# Altium schematic sheet 05 SERVO_FAN_LED.SchDoc
size A
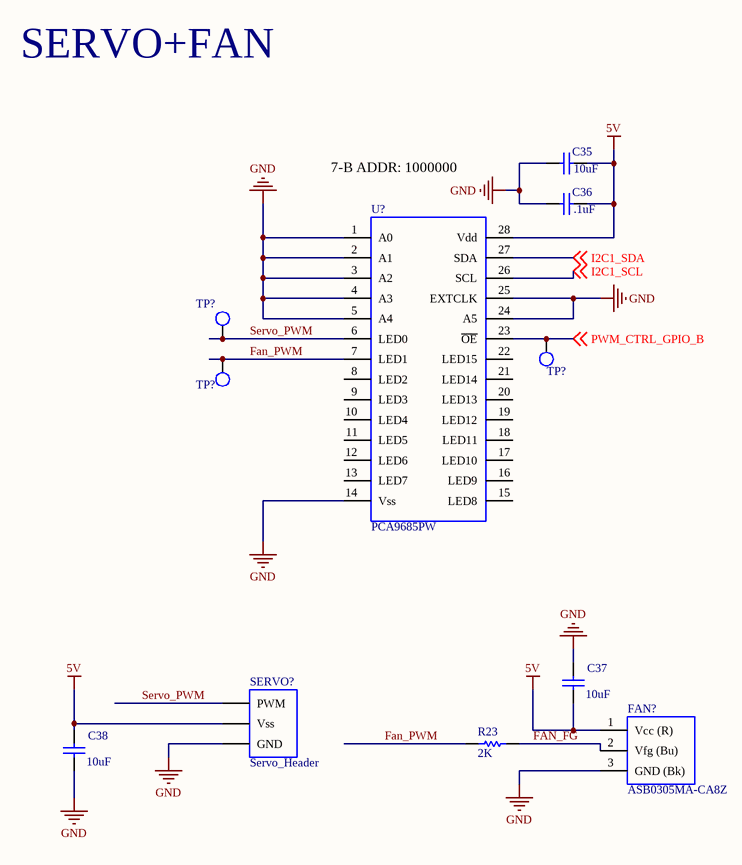
[diagram p0: 05 SERVO_FAN_LED.SchDoc]

## Parts
(Parts that share a designator on the sheet are numbered #1, #2 ... from top to bottom, then left to right.)
C35  value 10uF  [CAPC2012X135N]  (hidden comment: CAP_0805_10u_16V)
C36  value .1uF  [CAPC2012X135N]  (hidden comment: CAP_0805_.1u_250V)
C37  value 10uF  [CAPC2012X135N]  (hidden comment: CAP_0805_10u_16V)
C38  value 10uF  [CAPC2012X135N]  (hidden comment: CAP_0805_10u_16V)
FAN?  ASB0305MA-CA8Z  [FAN_HEADER]
R23  RES_0805_2K  [RES0805]  (value not drawn)
SERVO?  Servo_Header
TP?#1  TP  [TestPoint_1206]  (value not drawn)
TP?#2  TP  [TestPoint_1206]  (value not drawn)
TP?#3  TP  [TestPoint_1206]  (value not drawn)
U?  PCA9685PW  [TSSOP28]

## Nets
5V: C35.2 C36.2 C37.1 C38.2 FAN?.1(Vcc_(R)) SERVO?.2(Vss) U?.28(Vdd)
GND: C35.1 C36.1 C37.2 C38.1 FAN?.3(GND_(Bk)) SERVO?.3(GND) U?.1(A0) U?.2(A1) U?.3(A2) U?.4(A3) U?.5(A4) U?.14(Vss) U?.24(A5) U?.25(EXTCLK)
FAN_FG: FAN?.2(Vfg_(Bu)) R23.2
Fan_PWM: R23.1 TP?#3.1 U?.7(LED1)
I2C1_SCL: U?.26(SCL) ; off-sheet I2C1_SCL
I2C1_SDA: U?.27(SDA) ; off-sheet I2C1_SDA
PWM_CTRL_GPIO_B: TP?#2.1 U?.23(~{OE}) ; off-sheet PWM_CTRL_GPIO_B
Servo_PWM: SERVO?.1(PWM) TP?#1.1 U?.6(LED0)

Not connected (* = marked no-connect by the designer): U? 8(LED2) 9(LED3) 10(LED4) 11(LED5) 12(LED6) 13(LED7) 15(LED8) 16(LED9) 17(LED10) 18(LED11) 19(LED12) 20(LED13) 21(LED14) 22(LED15)

## Notes on the sheet
- SERVO+FAN
- 7-B ADDR: 1000000
- (in symbol RES_0805_2K) 2K

## Library data of the parts
C35 C37 C38 = CAP_0805_10u_16V: Cap Ceramic 10uF 16V X5R 10% SMD 0805 85C T/R; Manufacturer: Johanson Dielectrics; Manufacturer Part Number: 160R15X106KV4E; Supplier 1: Digi-Key; Supplier Part Number 1: 709-1229-1-ND; Stock 1: 36636; Pricing 1: 1=0.55, 10=0.387, 100=0.2552, 500=0.189, 1000=0.1607 (USD); Mount: Surface Mount; Case/Package: 0805; Number of Pins: 2; Weight: 0.000194oz; Case Code (Imperial): 0805; Case Code (Metric): 2012; Min Operating Temperature: -55°C; Max Operating Temperature: 85°C; Voltage Rating: 16V; Capacitance: 10uF; Voltage Rating (DC): 16V; Tolerance: 10%; Packaging: Tape and Reel; Package Quantity: 2000; Dielectric: X5R; Termination: SMD/SMT; Length: 2.03mm; Height: 1.27mm; Width: 1.27mm; Thickness: 0.06inch; Depth: 1.27mm; Radiation Hardening: No; REACH SVHC: No SVHC; ComponentLink1URL: https://datasheet.ciiva.com/26948/getdatasheetpartid-132904-26948555.pdf; ComponentLink1Description: https://datasheet.ciiva.com/26948/getdatasheetpartid-132904-26948555.pdf
C36 = CAP_0805_.1u_250V: Cap Ceramic 0.1uF 250V X7T 10% SMD 0805 125C Plastic T/R; Manufacturer: TDK; Manufacturer Part Number: C2012X7T2E104K125AE; Capacitance: 100nF; Supplier 1: Digi-Key; Supplier Part Number 1: 445-8883-1-ND; Stock 1: 30376; Pricing 1: 1=0.37, 10=0.25, 100=0.1419, 500=0.1002, 1000=0.0877 (USD); Case/Package: 0805; Weight: 0.000194oz; Case Code (Metric): 2012; Case Code (Imperial): 0805; Min Operating Temperature: -55°C; Max Operating Temperature: 125°C; Package Quantity: 1; Voltage Rating: 250V; Tolerance: 10%; Packaging: Tape and Reel; Voltage Rating (DC): 250V; Dielectric: X7T; Termination: SMD/SMT; Composition: Ceramic; Length: 2mm; Height: 1.25mm; Width: 0.05inch; Thickness: 0.049inch; Depth: 1.25mm; REACH SVHC: No SVHC; ComponentLink1URL: https://datasheet.ciiva.com/24219/c2012x7t2e104k125ae-265154-24219519.pdf; ComponentLink1Description: https://datasheet.ciiva.com/24219/c2012x7t2e104k125ae-265154-24219519.pdf
FAN? = ASB0305MA-CA8Z: FAN AXIAL 30X10MM 5VDC WIRE; Manufacturer: Delta Design; Airflow: 3.4CFM; Noise: 23dBA; Current Rating: 110mA; Max Power Dissipation: 550mW; RPM: 9000RPM; Bearing Type: Sleeve; Supplier 1: Digi-Key; Supplier Part Number 1: 603-1847-ND; Manufacturer Part Number: ASB0305MA-CA8Z; Stock 1: 98; Pricing 1: 1=6.96, 10=6.38, 50=5.365 (USD); Weight: 0.015lb; Min Operating Temperature: 14°C; Max Operating Temperature: 158°C; Package Quantity: 720; Termination: 3 Wire Leads; Width: 10mm; ComponentLink1URL: //media.digikey.com/pdf/Data%20Sheets/Delta%20PDFs/ASB0305MA-CA8Z_Spec.pdf; ComponentLink1Description: //media.digikey.com/pdf/Data%20Sheets/Delta%20PDFs/ASB0305MA-CA8Z_Spec.pdf
R23 = RES_0805_2K: RES SMD 2K OHM 5% 1/8W 0805; Manufacturer: Yageo; Manufacturer Part Number: RC0805JR-072KL; Resistance: 2KR; Power Rating: 125mW; Voltage Rating: 150V; Temperature Coefficient: 100ppm/°C; Supplier 1: Digi-Key; Supplier Part Number 1: 311-2.0KARCT-ND; Stock 1: 297667; Pricing 1: 1=0.1, 10=0.016, 25=0.0116, 50=0.009, 100=0.0066, 250=0.005, 500=0.004, 1000=0.003 (USD); Case/Package: 0805; Number of Pins: 2; Case Code (Metric): 2012; Case Code (Imperial): 0805; Contact Plating: Tin,Lead,Matte; Min Operating Temperature: -55°C; Max Operating Temperature: 155°C; Tolerance: 5%; Packaging: Tape and Reel; Package Quantity: 1; Composition: Thick Film; Number of Terminations: 2; Termination: SMD/SMT; Military Standard: Not; Max Power Dissipation: 125mW; Voltage Rating (DC): 150V; Length: 2mm; Height: 0.024inch; Width: 0.049inch; Depth: 1.25mm; Radiation Hardening: No; REACH SVHC: No SVHC; Lead Free: Lead Free; ComponentLink1URL: https://datasheet.ciiva.com/46395/444164-46395141.pdf; ComponentLink1Description: https://datasheet.ciiva.com/46395/444164-46395141.pdf; ComponentLink2URL: https://datasheet.ciiva.com/2456/pyu-r-int-thick-7-2456104.pdf; ComponentLink2Description: https://datasheet.ciiva.com/2456/pyu-r-int-thick-7-2456104.pdf; ComponentLink3URL: https://datasheet.ciiva.com/2456/pyu-r-int-thick-7-2456105.pdf; ComponentLink3Description: https://datasheet.ciiva.com/2456/pyu-r-int-thick-7-2456105.pdf; ComponentLink4URL: https://datasheet.ciiva.com/2456/pyu-r-int-thick-7-2456106.pdf; ComponentLink4Description: https://datasheet.ciiva.com/2456/pyu-r-int-thick-7-2456106.pdf; ComponentLink5URL: https://datasheet.ciiva.com/12666/rc0805-12666941.pdf; ComponentLink5Description: https://datasheet.ciiva.com/12666/rc0805-12666941.pdf
SERVO? = Servo_Header: Board-To-Board Connector, Vertical, WR-PHD Series, Through Hole, Header, 3 Contacts, 2.54 mm; Manufacturer: Wurth Electronics; Manufacturer Part Number: 61300311121; Number of Positions: 3; Gender: Male; Connector Type: Male Pin; Pitch: 0.1inch; Supplier 1: Digi-Key; Supplier 2: Digi-Key; Supplier Part Number 1: 900-00008-ND; Supplier Part Number 2: 732-5316-ND; Stock 2: 24543; Pricing 2: 1=0.13, 10=0.106, 25=0.088, 50=0.074, 100=0.067, 1000=0.061 (USD); Mount: Through Hole; Case/Package: 100; Contact Plating: Gold; Contact Material: Copper; Colour: Black; Number of Rows: 1; Packaging: Bulk; Termination: Solder; Number of Contacts: 3; Contact Mating Length: 0.236inch; REACH SVHC: Unknown; Lead Free: Lead Free; ComponentLink1URL: http://www.farnell.com/cad/1737268.pdf; ComponentLink1Description: http://www.farnell.com/cad/1737268.pdf
TP?#1-TP?#3 = TP: Res 1206 0 Ohm Molded SMD T/R; Manufacturer: TE Connectivity; Manufacturer Part Number: 1625854-4; Resistance: 0mR; Supplier 1: Digi-Key; Stock 1: 23359; Pricing 1: 1=0.28, 10=0.261, 25=0.224, 50=0.1902, 100=0.1828, 250=0.1641, 500=0.1567, 1000=0.1306 (USD); Case/Package: 1206; Colour: Natural; Min Operating Temperature: -55°C; Max Operating Temperature: 125°C; Packaging: Tape and Reel; Package Quantity: 2000; Military Standard: Not; Length: 3.2mm; Depth: 1.6mm; Radiation Hardening: No; Lead Free: Lead Free; ComponentLink1URL: https://datasheet.ciiva.com/16499/1625854-4-16499923.pdf; ComponentLink1Description: https://datasheet.ciiva.com/16499/1625854-4-16499923.pdf; ComponentLink2URL: https://datasheet.ciiva.com/6439/eng-ds-1773266-a-6439173.pdf; ComponentLink2Description: https://datasheet.ciiva.com/6439/eng-ds-1773266-a-6439173.pdf; ComponentLink3URL: https://datasheet.ciiva.com/6439/eng-ds-1773266-a-6439161.pdf; ComponentLink3Description: https://datasheet.ciiva.com/6439/eng-ds-1773266-a-6439161.pdf; ComponentLink4URL: https://datasheet.ciiva.com/36535/eng-ds-1773266-a-36535790.pdf; ComponentLink4Description: https://datasheet.ciiva.com/36535/eng-ds-1773266-a-36535790.pdf; Supplier Part Number 1: A106146CT-ND
U? = PCA9685PW: IC LED DRIVER RGBA 28-TSSOP; Manufacturer: NXP Semiconductors; Manufacturer Part Number: PCA9685PW,118; Number of Outputs: 16; Frequency: 1MHz; Max Supply Voltage: 5.5V; Min Supply Voltage: 2.3V; Nominal Supply Current: 10A; Output Current per Channel: 25mA; High Level Output Current: 10mA; Low Level Output Current: 400A; Power Dissipation: 400W; Supplier 1: Digi-Key; Stock 1: 2599; Pricing 1: 1=2.31, 10=2.074, 100=1.6674, 500=1.3699, 1000=1.1351 (USD); Mount: Surface Mount; Case/Package: TSSOP; Number of Pins: 28; Min Operating Temperature: -40°C; Max Operating Temperature: 85°C; Packaging: Tape and Reel; Package Quantity: 2500; Output Voltage: 5.5V; Radiation Hardening: No; Lead Free: Lead Free; ComponentLink1URL: https://datasheet.ciiva.com/1947/pca9685-1947062.pdf; ComponentLink1Description: https://datasheet.ciiva.com/1947/pca9685-1947062.pdf; ComponentLink2URL: https://datasheet.ciiva.com/15134/getdatasheetpartid-103066-15134201.pdf; ComponentLink2Description: https://datasheet.ciiva.com/15134/getdatasheetpartid-103066-15134201.pdf; ComponentLink3URL: https://datasheet.ciiva.com/8125/pca9685-8125357.pdf; ComponentLink3Description: https://datasheet.ciiva.com/8125/pca9685-8125357.pdf; Supplier Part Number 1: 568-11925-1-ND